# EAGLE design led_analog_watch_face_v1 (EAGLE 5.11)
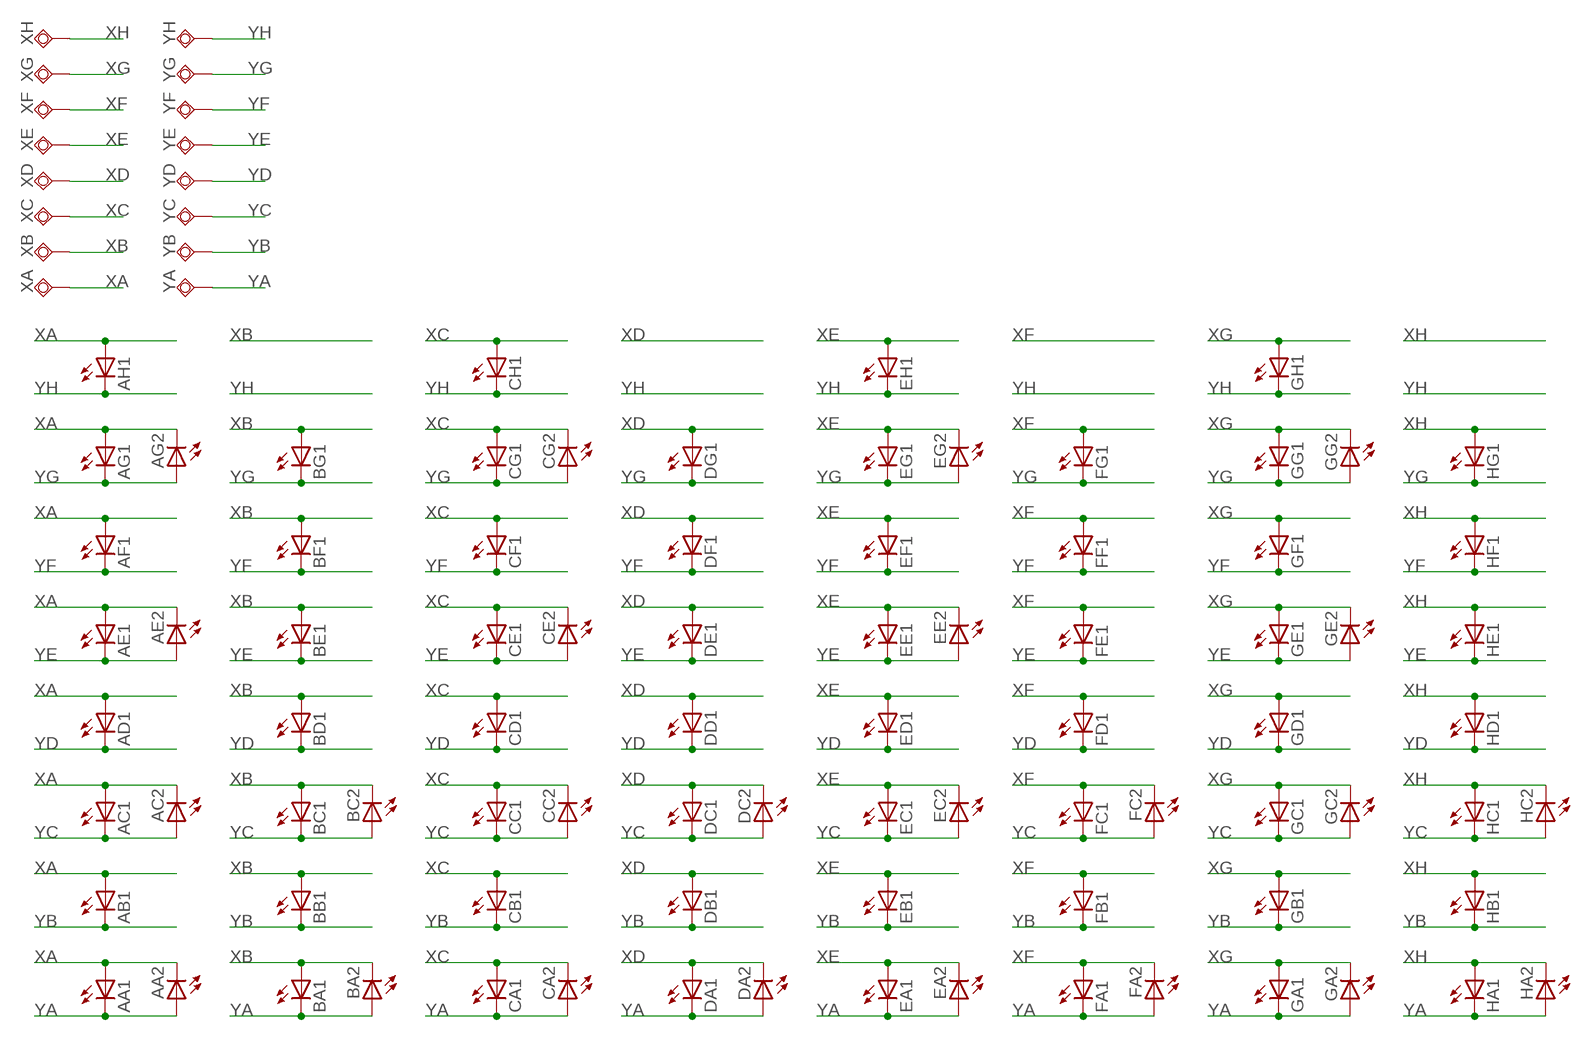
[diagram p0: schematic, sheet 1]

## Parts
AA1  LED0402  [LED-0402]
AA2  LED0402  [LED-0402]
AB1  LED0402  [LED-0402]
AC1  LED0402  [LED-0402]
AC2  LED0402  [LED-0402]
AD1  LED0402  [LED-0402]
AE1  LED0402  [LED-0402]
AE2  LED0402  [LED-0402]
AF1  LED0402  [LED-0402]
AG1  LED0402  [LED-0402]
AG2  LED0402  [LED-0402]
AH1  LED0402  [LED-0402]
BA1  LED0402  [LED-0402]
BA2  LED0402  [LED-0402]
BB1  LED0402  [LED-0402]
BC1  LED0402  [LED-0402]
BC2  LED0402  [LED-0402]
BD1  LED0402  [LED-0402]
BE1  LED0402  [LED-0402]
BF1  LED0402  [LED-0402]
BG1  LED0402  [LED-0402]
CA1  LED0402  [LED-0402]
CA2  LED0402  [LED-0402]
CB1  LED0402  [LED-0402]
CC1  LED0402  [LED-0402]
CC2  LED0402  [LED-0402]
CD1  LED0402  [LED-0402]
CE1  LED0402  [LED-0402]
CE2  LED0402  [LED-0402]
CF1  LED0402  [LED-0402]
CG1  LED0402  [LED-0402]
CG2  LED0402  [LED-0402]
CH1  LED0402  [LED-0402]
DA1  LED0402  [LED-0402]
DA2  LED0402  [LED-0402]
DB1  LED0402  [LED-0402]
DC1  LED0402  [LED-0402]
DC2  LED0402  [LED-0402]
DD1  LED0402  [LED-0402]
DE1  LED0402  [LED-0402]
DF1  LED0402  [LED-0402]
DG1  LED0402  [LED-0402]
EA1  LED0402  [LED-0402]
EA2  LED0402  [LED-0402]
EB1  LED0402  [LED-0402]
EC1  LED0402  [LED-0402]
EC2  LED0402  [LED-0402]
ED1  LED0402  [LED-0402]
EE1  LED0402  [LED-0402]
EE2  LED0402  [LED-0402]
EF1  LED0402  [LED-0402]
EG1  LED0402  [LED-0402]
EG2  LED0402  [LED-0402]
EH1  LED0402  [LED-0402]
FA1  LED0402  [LED-0402]
FA2  LED0402  [LED-0402]
FB1  LED0402  [LED-0402]
FC1  LED0402  [LED-0402]
FC2  LED0402  [LED-0402]
FD1  LED0402  [LED-0402]
FE1  LED0402  [LED-0402]
FF1  LED0402  [LED-0402]
FG1  LED0402  [LED-0402]
GA1  LED0402  [LED-0402]
GA2  LED0402  [LED-0402]
GB1  LED0402  [LED-0402]
GC1  LED0402  [LED-0402]
GC2  LED0402  [LED-0402]
GD1  LED0402  [LED-0402]
GE1  LED0402  [LED-0402]
GE2  LED0402  [LED-0402]
GF1  LED0402  [LED-0402]
GG1  LED0402  [LED-0402]
GG2  LED0402  [LED-0402]
GH1  LED0402  [LED-0402]
HA1  LED0402  [LED-0402]
HA2  LED0402  [LED-0402]
HB1  LED0402  [LED-0402]
HC1  LED0402  [LED-0402]
HC2  LED0402  [LED-0402]
HD1  LED0402  [LED-0402]
HE1  LED0402  [LED-0402]
HF1  LED0402  [LED-0402]
HG1  LED0402  [LED-0402]
XA  TPSQTP15SQ  [TP15SQ]
XB  TPSQTP15SQ  [TP15SQ]
XC  TPSQTP15SQ  [TP15SQ]
XD  TPSQTP15SQ  [TP15SQ]
XE  TPSQTP15SQ  [TP15SQ]
XF  TPSQTP15SQ  [TP15SQ]
XG  TPSQTP15SQ  [TP15SQ]
XH  TPSQTP15SQ  [TP15SQ]
YA  TPSQTP15SQ  [TP15SQ]
YB  TPSQTP15SQ  [TP15SQ]
YC  TPSQTP15SQ  [TP15SQ]
YD  TPSQTP15SQ  [TP15SQ]
YE  TPSQTP15SQ  [TP15SQ]
YF  TPSQTP15SQ  [TP15SQ]
YG  TPSQTP15SQ  [TP15SQ]
YH  TPSQTP15SQ  [TP15SQ]

## Nets
XA: AA1.1(A) AA2.2(C) AB1.1(A) AC1.1(A) AC2.2(C) AD1.1(A) AE1.1(A) AE2.2(C) AF1.1(A) AG1.1(A) AG2.2(C) AH1.1(A) XA.TP
XB: BA1.1(A) BA2.2(C) BB1.1(A) BC1.1(A) BC2.2(C) BD1.1(A) BE1.1(A) BF1.1(A) BG1.1(A) XB.TP
XC: CA1.1(A) CA2.2(C) CB1.1(A) CC1.1(A) CC2.2(C) CD1.1(A) CE1.1(A) CE2.2(C) CF1.1(A) CG1.1(A) CG2.2(C) CH1.1(A) XC.TP
XD: DA1.1(A) DA2.2(C) DB1.1(A) DC1.1(A) DC2.2(C) DD1.1(A) DE1.1(A) DF1.1(A) DG1.1(A) XD.TP
XE: EA1.1(A) EA2.2(C) EB1.1(A) EC1.1(A) EC2.2(C) ED1.1(A) EE1.1(A) EE2.2(C) EF1.1(A) EG1.1(A) EG2.2(C) EH1.1(A) XE.TP
XF: FA1.1(A) FA2.2(C) FB1.1(A) FC1.1(A) FC2.2(C) FD1.1(A) FE1.1(A) FF1.1(A) FG1.1(A) XF.TP
XG: GA1.1(A) GA2.2(C) GB1.1(A) GC1.1(A) GC2.2(C) GD1.1(A) GE1.1(A) GE2.2(C) GF1.1(A) GG1.1(A) GG2.2(C) GH1.1(A) XG.TP
XH: HA1.1(A) HA2.2(C) HB1.1(A) HC1.1(A) HC2.2(C) HD1.1(A) HE1.1(A) HF1.1(A) HG1.1(A) XH.TP
YA: AA1.2(C) AA2.1(A) BA1.2(C) BA2.1(A) CA1.2(C) CA2.1(A) DA1.2(C) DA2.1(A) EA1.2(C) EA2.1(A) FA1.2(C) FA2.1(A) GA1.2(C) GA2.1(A) HA1.2(C) HA2.1(A) YA.TP
YB: AB1.2(C) BB1.2(C) CB1.2(C) DB1.2(C) EB1.2(C) FB1.2(C) GB1.2(C) HB1.2(C) YB.TP
YC: AC1.2(C) AC2.1(A) BC1.2(C) BC2.1(A) CC1.2(C) CC2.1(A) DC1.2(C) DC2.1(A) EC1.2(C) EC2.1(A) FC1.2(C) FC2.1(A) GC1.2(C) GC2.1(A) HC1.2(C) HC2.1(A) YC.TP
YD: AD1.2(C) BD1.2(C) CD1.2(C) DD1.2(C) ED1.2(C) FD1.2(C) GD1.2(C) HD1.2(C) YD.TP
YE: AE1.2(C) AE2.1(A) BE1.2(C) CE1.2(C) CE2.1(A) DE1.2(C) EE1.2(C) EE2.1(A) FE1.2(C) GE1.2(C) GE2.1(A) HE1.2(C) YE.TP
YF: AF1.2(C) BF1.2(C) CF1.2(C) DF1.2(C) EF1.2(C) FF1.2(C) GF1.2(C) HF1.2(C) YF.TP
YG: AG1.2(C) AG2.1(A) BG1.2(C) CG1.2(C) CG2.1(A) DG1.2(C) EG1.2(C) EG2.1(A) FG1.2(C) GG1.2(C) GG2.1(A) HG1.2(C) YG.TP
YH: AH1.2(C) CH1.2(C) EH1.2(C) GH1.2(C) YH.TP

## Library data of the parts
AA1 AA2 AB1 AC1 AC2 AD1 AE1 AE2 AF1 AG1 AG2 AH1 BA1 BA2 BB1 BC1 BC2 BD1 BE1 BF1 BG1 CA1 CA2 CB1 CC1 CC2 CD1 CE1 CE2 CF1 CG1 CG2 CH1 DA1 DA2 DB1 DC1 DC2 DD1 DE1 DF1 DG1 EA1 EA2 EB1 EC1 EC2 ED1 EE1 EE2 EF1 EG1 EG2 EH1 FA1 FA2 FB1 FC1 FC2 FD1 FE1 FF1 FG1 GA1 GA2 GB1 GC1 GC2 GD1 GE1 GE2 GF1 GG1 GG2 GH1 HA1 HA2 HB1 HC1 HC2 HD1 HE1 HF1 HG1 = jcole:LED: LEDs Standard schematic elements and footprints for 5mm, 3mm, 1206, and 0603 sized LEDs. 5mm - Spark Fun Electronics SKU : COM-00529 (and others)
XA XB XC XD XE XF XG XH YA YB YC YD YE YF YG YH = testpad:TPSQ: Test pad

## Net classes
0 signal: width 0.203 mm
1 supply: width 0.305 mm

## Board
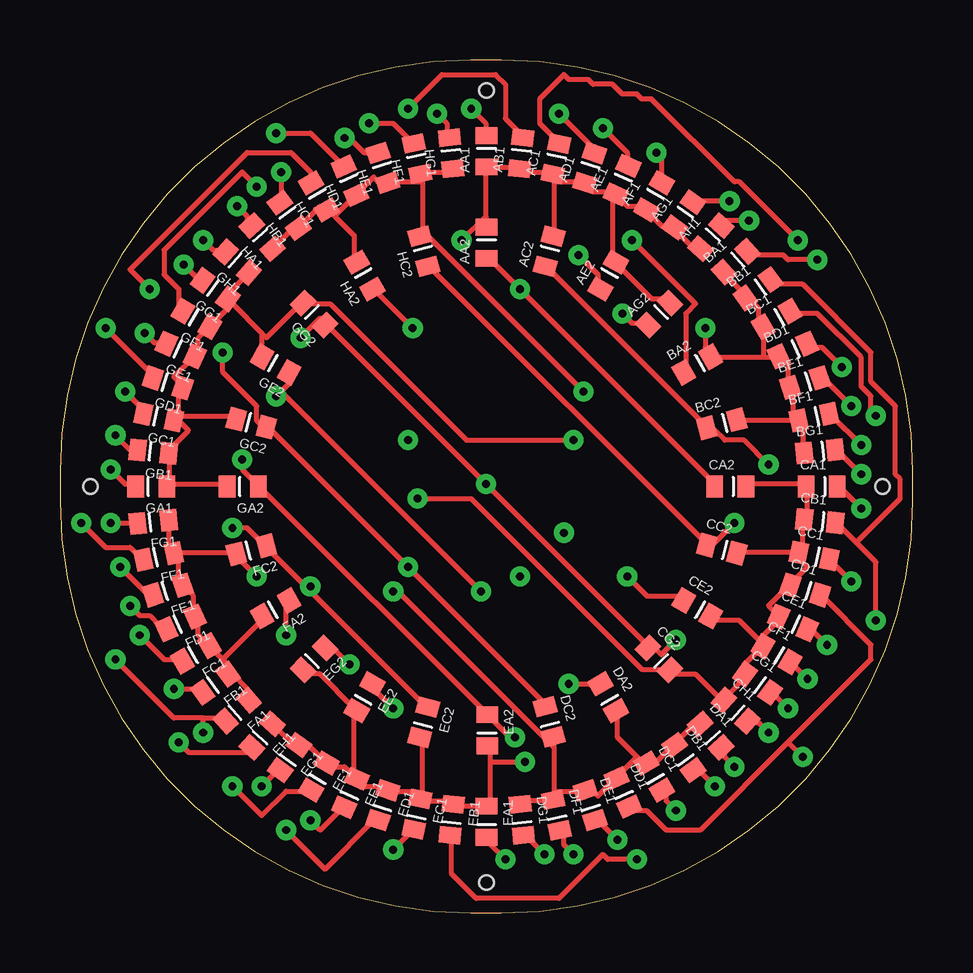
[diagram p1: board, top side]
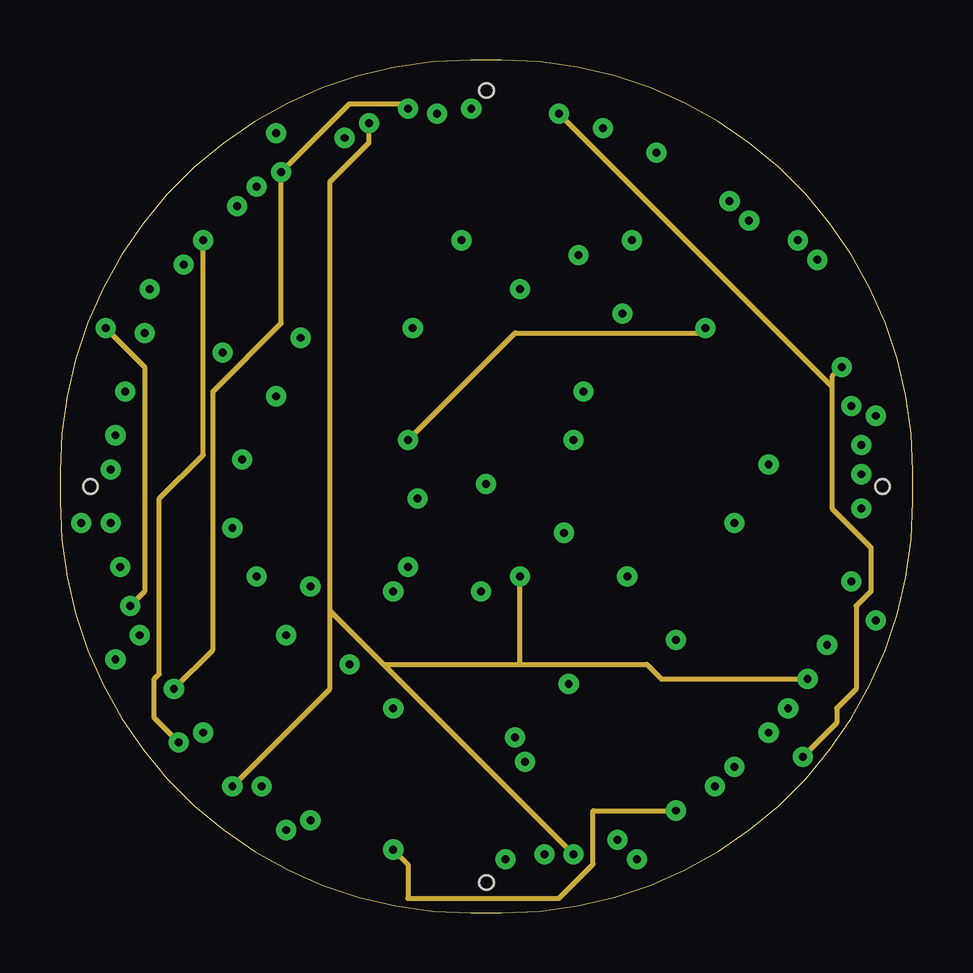
[diagram p2: board, inner layer Route2]
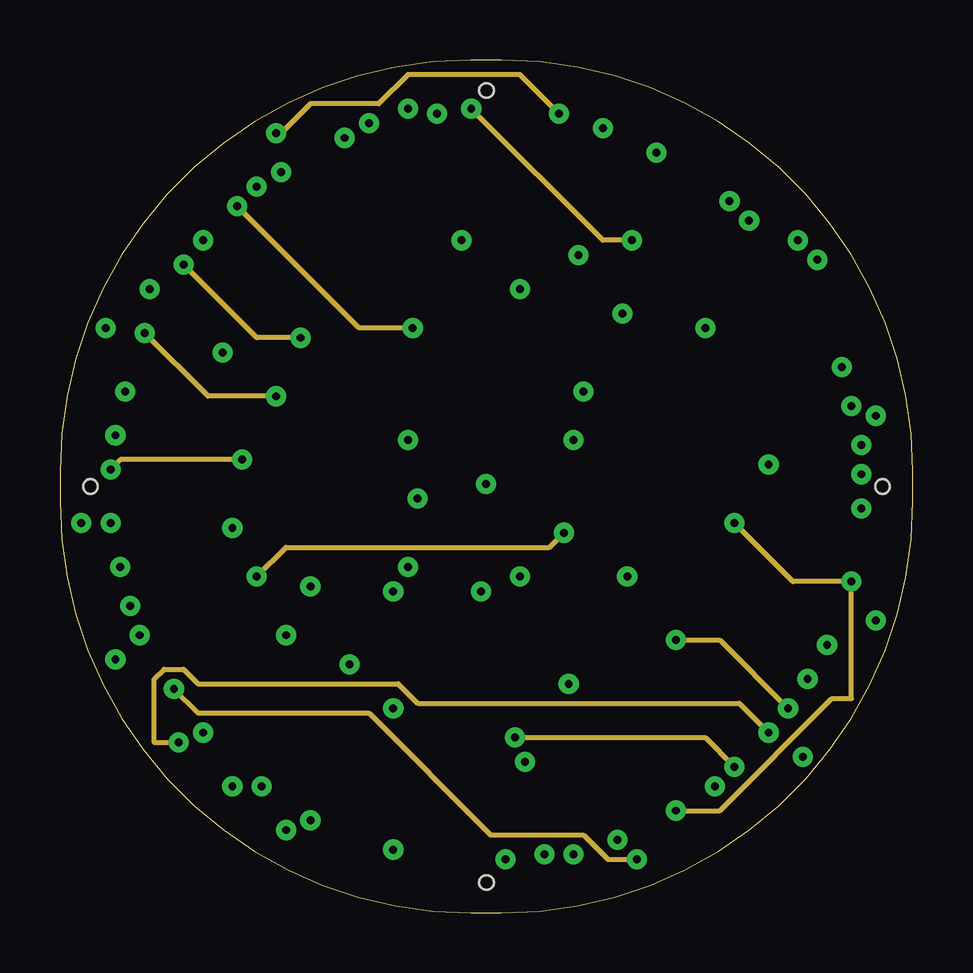
[diagram p3: board, inner layer Route15]
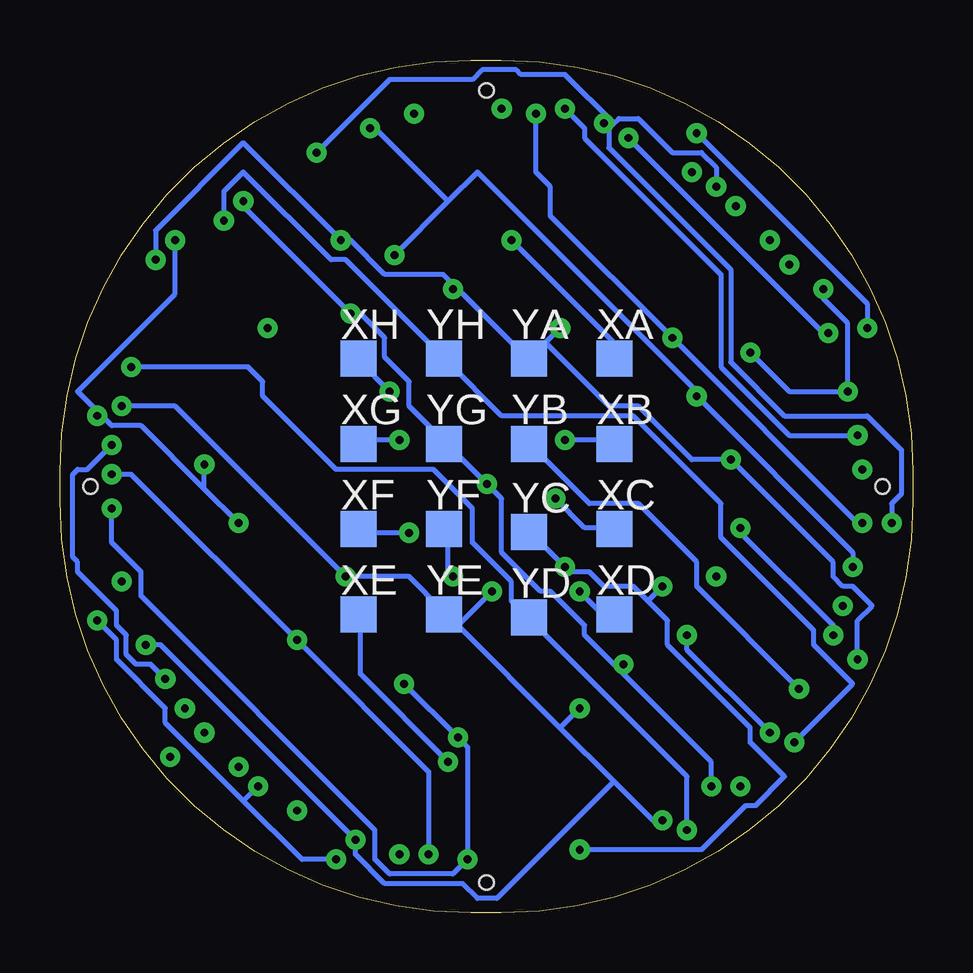
[diagram p4: board, bottom side, seen from below]

Size 35.56 x 35.56 mm. Coordinates in mm from the lower left corner, seen from the top.
Outline: 18.42,0 arc90 35.56,17.14 35.56,18.41 arc90 18.42,35.56 17.14,35.56 arc90 0,18.41 0,17.14 arc90 17.14,0 18.42,0
Copper layers (1*2*15*16): Top 0.035mm / dielectric 0.6mm / Route2 0.035mm / dielectric 0.15mm / Route15 0.035mm / dielectric 0.6mm / Bottom 0.035mm
Design rules "SparkFun *": minimum track width 8mil, minimum drill 13mil, track to track 8mil, track to pad 8mil, pad to pad 8mil, via to via 8mil, smd to smd 8mil, copper to edge 10mil, drill to drill 8mil, minimum pad ring 12mil, minimum via ring 10mil, stop-mask expansion 4mil, vias tented up to drill 25mil, thermal gap 10mil
Holes 0.6 mm at 17.78,1.27 34.29,17.78 1.27,17.78 17.78,34.29

### Footprints (pad centres in the part's own frame; a part is rotated, then mirrored left to right if it is on the bottom)
LED-0402 = smd 0.9 x 0.7: 1 0,-0.65; 2 0,0.65
TP15SQ = smd 1.5 x 1.5: TP 0,0

### Placement (x,y rotation side)
AA1  17.78,31.75 0 top
AA2  17.78,27.94 0 top
AB1  19.23,31.67 354 top
AC1  20.68,31.44 348 top
AC2  20.4,27.58 345 top
AD1  22.08,31.06 342 top
AE1  23.43,30.55 336 top
AE2  22.86,26.57 330 top
AF1  24.77,29.88 330 top
AG1  26,29.1 324 top
AG2  24.97,24.97 315 top
AH1  27.14,28.18 318 top
BA1  28.17,27.15 312 top
BA2  26.57,22.86 300 top
BB1  29.1,26.02 306 top
BC1  29.87,24.76 300 top
BC2  27.58,20.4 285 top
BD1  30.55,23.47 294 top
BE1  31.06,22.11 288 top
BF1  31.43,20.67 282 top
BG1  31.67,19.25 276 top
CA1  31.75,17.78 270 top
CA2  27.94,17.78 270 top
CB1  31.67,16.33 264 top
CC1  31.45,14.88 258 top
CC2  27.58,15.16 255 top
CD1  31.06,13.46 252 top
CE1  30.56,12.09 246 top
CE2  26.57,12.7 240 top
CF1  29.87,10.79 240 top
CG1  29.08,9.58 234 top
CG2  24.97,10.59 225 top
CH1  28.17,8.43 228 top
DA1  27.13,7.39 222 top
DA2  22.86,8.99 210 top
DB1  26.01,6.48 216 top
DC1  24.77,5.69 210 top
DC2  20.4,7.98 195 top
DD1  23.47,5.03 204 top
DE1  22.1,4.5 198 top
DF1  20.7,4.09 192 top
DG1  19.25,3.89 186 top
EA1  17.78,3.81 180 top
EA2  17.81,7.62 180 top
EB1  16.33,3.89 174 top
EC1  14.88,4.11 168 top
EC2  15.16,7.95 165 top
ED1  13.46,4.5 162 top
EE1  12.12,5 156 top
EE2  12.7,8.99 150 top
EF1  10.79,5.69 150 top
EG1  9.58,6.48 144 top
EG2  10.59,10.59 135 top
EH1  8.43,7.39 138 top
FA1  7.39,8.43 132 top
FA2  8.99,12.7 120 top
FB1  6.48,9.58 126 top
FC1  5.66,10.82 120 top
FC2  7.98,15.14 105 top
FD1  5.03,12.09 114 top
FE1  4.5,13.46 108 top
FF1  4.11,14.86 102 top
FG1  3.89,16.31 96 top
GA1  3.81,17.78 90 top
GA2  7.62,17.78 90 top
GB1  3.89,19.23 84 top
GC1  4.11,20.68 78 top
GC2  7.98,20.42 75 top
GD1  4.5,22.1 72 top
GE1  5.03,23.47 66 top
GE2  8.99,22.86 60 top
GF1  5.69,24.77 60 top
GG1  6.48,25.98 54 top
GG2  10.59,24.97 45 top
GH1  7.39,27.13 48 top
HA1  8.43,28.17 42 top
HA2  12.7,26.57 30 top
HB1  9.55,29.08 36 top
HC1  10.79,29.87 30 top
HC2  15.16,27.58 15 top
HD1  12.09,30.53 24 top
HE1  13.46,31.06 18 top
HF1  14.88,31.45 12 top
HG1  16.31,31.67 6 top
XA  12.45,23.11 0 bottom
XB  12.45,19.56 0 bottom
XC  12.45,16 0 bottom
XD  12.45,12.45 0 bottom
XE  23.11,12.45 0 bottom
XF  23.11,16 0 bottom
XG  23.11,19.56 0 bottom
XH  23.11,23.11 0 bottom
YA  16,23.11 0 bottom
YB  16,19.56 0 bottom
YC  16,15.88 0 bottom
YD  16,12.32 0 bottom
YE  19.56,12.45 0 bottom
YF  19.56,16 0 bottom
YG  19.56,19.56 0 bottom
YH  19.56,23.11 0 bottom

### Tracks (layer width: path | path; a pad name or v marks a point on that pad's centre or on a via)
XA  (via drill 0.33)
  Top 0.203: AE1.1 23.04,30.07 22.23,30.07 22.02,30.28 AD1.1 21.82,30.48 20.6,30.48 | AE1.1 23.04,29.87 23.04,27.23 AE2.2 23.24,27.03 24.66,25.6 25.27,25.6 AG2.2 | AE1.1 23.24,29.87 23.65,29.46 24.26,29.46 AF1.1 24.46,29.26 25.07,28.65 25.48,28.65 AG1.1 25.68,28.45 26.29,27.84 26.7,27.84 AH1.1 | 17.76,29.06 17.76,31.09 AA1.1 17.96,31.09 18.97,31.09 AB1.1 19.18,30.89 20.4,30.89 AC1.1 | 17.76,29.06 17.76,28.65 AA2.2 | 20.6,30.48 20.6,30.68 AC1.1 | 20.6,30.48 20.6,28.25 AC2.2 | v16.74,28.04 17.76,29.06 | AC1.1 20.6,30.48
  Bottom 0.203: v16.74,28.04 12.47,23.77 12.47,23.16 XA.TP
XB  (via drill 0.33)
  Top 0.203: BC2.2 28.32,20.52 30.76,20.52 BF1.1 | BG1.1 30.96,19.3 30.96,20.52 BF1.1 | BF1.1 30.76,20.73 30.56,20.93 30.56,21.74 BE1.1 30.35,21.95 30.35,22.96 30.15,23.16 BD1.1 29.95,23.16 29.34,23.16 | BA1.1 27.71,26.62 28.52,25.81 BB1.1 28.73,25.6 29.13,25.2 29.13,24.59 BC1.1 29.34,24.38 29.34,23.16 | 29.34,23.16 27.3,23.16 BA2.2 27.1,23.37 26.9,23.57 v26.9,24.38
  Route2 0.203: v14.5,19.71 18.97,24.18 26.9,24.18 v26.9,24.38
  Bottom 0.203: v14.5,19.71 12.47,19.71 XB.TP
XC  (via drill 0.33)
  Top 0.203: CA2.2 28.73,17.88 30.96,17.88 CA1.1 31.17,17.68 31.17,16.46 CB1.1 30.96,16.26 30.96,15.04 CC1.1 | CC1.1 30.76,14.83 31.17,14.43 30.56,13.82 CD1.1 30.35,13.61 29.54,12.8 29.95,12.39 CE1.1 29.95,12.19 29.13,11.38 | CC2.2 28.32,15.04 30.76,15.04 CC1.1 | CF1.1 29.13,10.97 28.52,10.36 28.73,10.16 CG1.1 28.73,9.96 27.71,8.94 CH1.1 27.51,8.94 26.49,9.96 25.48,9.96 CG2.2 25.27,10.16 24.26,10.16 17.14,17.27 v14.91,17.27 | 29.13,11.38 29.34,11.18 CF1.1 | 29.13,11.38 28.32,12.19 27.3,12.19 CE2.2 | CF1.1 29.13,11.38
  Bottom 0.203: v14.91,17.27 13.69,16.05 12.47,16.05 XC.TP
XD  (via drill 0.33)
  Top 0.203: DA1.1 26.49,7.92 25.68,7.11 DB1.1 25.48,6.91 24.66,6.1 24.46,6.3 DC1.1 24.26,6.3 24.05,6.5 | 24.05,6.5 23.24,5.69 DD1.1 23.04,5.49 22.43,4.88 22.02,5.28 DE1.1 21.82,5.08 20.6,5.08 | 24.05,6.5 23.24,7.32 23.24,8.33 DA2.2 | DG1.1 19.38,4.67 20.4,4.67 DF1.1 | 20.6,5.08 20.6,4.88 DF1.1 | 20.6,6.91 20.6,5.08 | 20.6,6.91 20.6,7.32 DC2.2 | 20.6,5.08 DF1.1 | v13.89,13.41 14.1,13.41 20.6,6.91
  Bottom 0.203: v13.89,13.41 13.08,12.6 12.47,12.6 XD.TP
XE  (via drill 0.33)
  Top 0.203: EH1.1 9.02,7.72 9.63,7.11 9.83,7.11 EG1.1 10.03,6.91 10.44,6.91 11.05,6.3 EF1.1 11.25,6.1 11.86,6.1 12.27,5.69 | 12.27,5.69 12.27,8.33 EE2.2 12.27,8.53 10.85,9.96 10.24,9.96 EG2.2 | 12.27,5.69 EE1.1 12.47,5.49 12.67,5.28 13.49,5.28 ED1.1 13.69,5.08 14.71,5.08 14.91,4.88 EC1.1 | EC2.2 15.11,7.32 15.11,4.88 EC1.1 | EC1.1 15.11,4.67 16.33,4.67 EB1.1 16.54,4.47 17.76,4.47 EA1.1 17.96,4.47 17.96,6.3 | 17.96,6.3 17.96,6.91 EA2.2 | 17.96,6.3 v19.38,6.3
  Bottom 0.203: v19.38,6.3 23.04,9.96 23.04,12.39 XE.TP
XF  (via drill 0.33)
  Top 0.203: 6.78,10.57 6.38,10.97 FC1.1 6.17,11.18 5.77,11.58 5.77,12.19 FD1.1 5.56,12.39 5.56,13.21 5.16,13.61 FE1.1 4.95,13.82 4.95,14.83 FF1.1 | 6.78,10.57 6.99,10.36 6.99,10.16 FB1.1 7.19,9.96 7.8,9.35 7.8,8.94 FA1.1 | 6.78,10.57 8.41,12.19 FA2.2 | FF1.1 4.95,15.04 7.19,15.04 FC2.2 7.39,14.83 v8.2,14.02 | FG1.1 4.55,16.26 4.55,15.24 4.75,15.04 FF1.1
  Route15 0.203: v21.01,15.85 20.4,15.24 9.42,15.24 v8.2,14.02
  Bottom 0.203: v21.01,15.85 23.04,15.85 XF.TP
XG  (via drill 0.33)
  Top 0.203: 4.55,17.88 4.55,19.1 GB1.1 4.55,19.3 5.36,20.12 4.95,20.52 GC1.1 4.95,20.73 | 4.55,17.88 6.78,17.88 GA2.2 | 4.55,17.88 GA1.1 | 4.95,20.73 4.95,21.74 GD1.1 5.16,21.95 4.75,22.35 5.56,23.16 GE1.1 5.77,23.37 5.77,23.98 6.17,24.38 GF1.1 6.38,24.59 7.19,25.4 | 4.95,20.73 7.19,20.73 GC2.2 | 8.41,24.18 8.41,23.37 GE2.2 | 7.19,25.4 8.41,24.18 | 7.19,25.4 GG1.1 7.19,25.6 6.99,25.81 7.8,26.62 GH1.1 | 8.41,24.18 8.61,23.98 10.03,25.4 GG2.2 10.24,25.4 11.25,25.4 16.94,19.71 v21.41,19.71
  Bottom 0.203: v21.41,19.71 23.04,19.71 XG.TP
XH  (via drill 0.33)
  Top 0.203: HA1.1 9.02,27.84 9.83,28.65 HB1.1 10.03,28.65 10.85,29.46 11.05,29.26 HC1.1 11.25,29.26 11.46,29.06 | 11.46,29.06 12.27,28.25 12.27,27.23 HA2.2 | 11.46,29.06 12.27,29.87 HD1.1 12.47,30.07 13.08,30.68 13.49,30.28 HE1.1 13.69,30.48 15.11,30.48 | 15.11,30.48 15.11,30.68 HF1.1 | 15.11,30.48 15.11,28.45 | 15.11,28.45 15.11,28.25 HC2.2 15.11,28.45 | 15.11,30.48 HF1.1 | HG1.1 16.33,30.89 15.11,30.89 HF1.1 | 15.11,28.45 v21.82,21.74
  Bottom 0.203: v21.82,21.74 23.04,22.96 XH.TP
YA  (via drill 0.33)
  Top 0.203: v18.57,2.23 17.96,2.85 17.96,3.05 EA1.2 | v18.97,7.32 18.77,7.32 17.96,8.13 EA2.1 17.76,8.33 8.41,17.68 GA2.1 8.2,17.88 7.6,18.49 v7.6,18.9 | v21.21,9.55 22.43,9.55 DA2.1 | v28.12,6.1 27.71,6.5 27.71,6.71 DA1.2 | v33.4,16.87 32.59,17.68 CA1.2 | CA2.1 27.1,17.88 27.1,18.09 v19.18,26.01 17.96,27.23 AA2.1 | v2.11,18.49 2.72,17.88 3.12,17.88 GA1.2 | 5.97,8.13 4.75,8.13 v2.31,10.57 | 5.97,8.13 6.78,8.13 FA1.2 | v9.42,11.58 9.42,13.01 FA2.1 | v5.97,7.52 5.97,8.13 | v14.71,24.38 13.28,25.81 13.08,25.81 HA2.1 | v7.39,29.46 7.8,29.06 7.8,28.85 HA1.2 | v23.85,28.04 26.49,25.4 26.09,24.99 26.09,22.55 BA2.1 | v31.57,27.23 30.35,27.23 30.15,27.43 28.73,27.43 BA1.2 | v17.14,33.53 17.76,32.92 17.76,32.51 AA1.2
  Route15 0.203: v28.12,6.1 26.9,7.32 v18.97,7.32 | v2.11,18.49 2.51,18.9 v7.6,18.9 | v7.39,29.46 12.47,24.38 v14.71,24.38 | v17.14,33.53 22.63,28.04 v23.85,28.04
  Bottom 0.203: v21.21,9.55 v18.97,7.32 18.57,6.91 v18.57,2.23 19.18,1.63 21.82,1.63 22.43,2.23 22.43,3.45 32.18,13.21 32.18,14.22 33.4,15.44 v33.4,16.87 | v2.31,10.57 2.31,12.19 1.7,12.8 2.51,13.61 2.92,13.61 3.33,14.02 3.33,14.63 v7.6,18.9 9.22,18.9 11.46,21.13 12.67,21.13 15.32,23.77 | v9.42,11.58 9.42,10.97 v5.97,7.52 | 15.32,23.77 15.93,23.16 YA.TP | 15.32,23.77 v14.71,24.38 | 18.97,26.01 16.13,23.16 YA.TP | 18.97,26.01 19.58,26.62 22.02,26.62 23.44,28.04 v23.85,28.04 27.92,32.11 31.57,28.45 v31.57,27.23 | 15.32,23.77 YA.TP | 18.97,26.01 v19.18,26.01
YB  (via drill 0.33)
  Top 0.203: v4.75,9.35 5.77,9.35 FB1.2 | v2.31,19.91 2.92,19.3 3.12,19.3 GB1.2 | v14.5,33.53 15.93,34.95 18.16,34.95 18.57,34.54 18.57,33.12 19.18,32.51 AB1.2 | v9.22,30.89 9.22,29.67 HB1.2 | v24.05,2.23 22.84,2.23 22.63,2.44 20.8,0.61 17.35,0.61 16.33,1.63 16.33,3.05 EB1.2 | v34.01,12.19 34.01,14.63 33.2,15.44 | 33.2,15.44 32.38,16.26 CB1.2 | v27.3,5.28 26.7,5.89 26.49,5.89 DB1.2 | 33.2,15.44 35.03,17.27 35.03,18.09 34.82,18.29 34.82,21.13 33.81,22.15 33.81,23.37 30.96,26.21 29.74,26.21 BB1.2
  Route2 0.203: v14.5,33.53 14.5,33.73 12.06,33.73 v9.22,30.89 9.22,24.59 6.38,21.74 6.38,10.97 v4.75,9.35
  Route15 0.203: v4.75,9.35 5.77,8.33 12.88,8.33 17.96,3.25 21.82,3.25 22.84,2.23 v24.05,2.23
  Bottom 0.203: v4.75,9.35 9.02,13.61 9.02,14.63 11.46,17.07 13.49,17.07 15.93,19.51 YB.TP | v2.31,19.91 5.16,19.91 8,22.76 8,26.62 13.69,32.31 13.69,32.72 v14.5,33.53 | v24.05,2.23 25.48,2.23 27.92,4.67 | 27.92,4.67 31.17,7.92 31.17,8.53 33.2,10.57 33.2,11.38 v34.01,12.19 | 27.92,4.67 v27.3,5.28
YC  (via drill 0.33)
  Top 0.203: DC2.1 20.19,8.74 v14.5,14.43 8.81,20.12 8.61,20.12 GC2.1 8.41,20.32 8.2,20.52 8.2,21.13 6.78,22.55 v6.78,23.37 | v2.72,21.74 3.33,21.13 3.33,20.93 GC1.2 | v3.73,26.01 2.92,26.82 7.8,31.7 9.63,31.7 10.44,30.89 10.44,30.48 HC1.2 | AC2.1 20.4,26.82 26.9,20.32 BC2.1 27.1,20.12 27.3,20.12 27.71,19.71 28.52,19.71 v29.54,18.69 | HC2.1 15.52,26.82 26.9,15.44 CC2.1 27.1,15.24 v28.12,16.26 | v34.01,20.73 33.81,20.93 33.81,21.54 33.4,21.95 33.4,23.16 31.57,24.99 30.56,24.99 BC1.2 | v30.76,28.04 28.32,30.48 28.12,30.48 24.66,33.93 24.26,33.93 24.05,34.14 23.44,34.14 23.04,34.54 22.23,34.54 22.02,34.75 21.21,34.75 21.01,34.95 19.99,33.93 19.99,32.92 20.8,32.11 AC1.2 | v3.33,11.58 4.34,10.57 4.95,10.57 FC1.2 | v7.19,16.05 7.8,16.05 8.41,15.44 FC2.1 8.61,15.24 10.44,13.41 | 10.44,13.41 15.11,8.74 15.32,8.74 EC2.1 | v13.89,2.64 14.71,3.45 EC1.2 | v25.68,4.27 25.27,4.67 25.27,5.08 DC1.2 | v32.99,13.82 32.18,14.63 CC1.2 | v10.44,13.61 10.44,13.41
  Route2 0.203: v25.68,4.27 22.23,4.27 22.23,2.03 20.8,0.61 14.5,0.61 14.5,2.03 v13.89,2.64
  Route15 0.203: v25.68,4.27 27.51,4.27 32.18,8.94 32.99,8.94 v32.99,13.82 30.56,13.82 v28.12,16.26
  Bottom 0.203: v6.78,23.37 5.16,21.74 v2.72,21.74 2.72,24.59 3.73,25.6 v3.73,26.01 | 33.81,20.73 33.4,20.32 32.18,20.32 29.54,17.68 | v28.12,16.26 29.54,17.68 | v30.76,28.04 30.76,25.81 34.82,21.74 33.81,20.73 | 33.81,20.73 v34.01,20.73 | 29.54,17.68 v29.54,18.69 | v3.33,11.58 3.33,11.99 7.19,15.85 v7.19,16.05 | v13.89,2.64 8.81,2.64 6.99,4.47 6.58,4.47 5.36,5.69 6.78,7.11 6.78,7.72 10.24,11.18 10.24,12.19 11.05,13.01 | 11.05,13.01 11.66,13.61 12.88,13.61 13.49,14.22 14.3,14.22 v14.5,14.43 15.93,15.85 YC.TP | 11.05,13.01 v10.44,13.61
YD  (via drill 0.33)
  Top 0.203: v1.91,24.38 3.73,22.55 3.73,22.35 GD1.2 | v9.02,32.51 10.44,32.51 11.66,31.29 HD1.2 | v2.92,12.8 3.33,12.39 3.73,12.39 4.14,11.99 4.34,11.99 FD1.2 | v20.8,33.33 22.23,31.9 22.23,31.7 AD1.2 | 30.35,7.11 33.81,10.57 33.81,11.18 31.78,13.21 CD1.2 | 30.35,7.11 26.7,3.45 25.27,3.45 24.46,4.27 23.85,4.27 DD1.2 | v9.42,3.45 11.05,1.83 13.08,3.86 ED1.2 | v32.59,22.76 31.78,23.57 31.17,23.57 BD1.2 | v30.96,6.5 30.35,7.11
  Route2 0.203: v2.92,12.8 3.53,13.41 3.53,22.76 v1.91,24.38 | v30.96,6.5 32.38,7.92 32.38,8.53 33.2,9.35 33.2,12.8 33.81,13.41 33.81,15.24 32.18,16.87 32.18,21.95 | 32.18,21.95 32.18,22.35 v32.59,22.76 | 32.18,21.95 v20.8,33.33
  Route15 0.203: v20.8,33.33 19.18,34.95 14.5,34.95 13.28,33.73 10.44,33.73 9.22,32.51 v9.02,32.51
  Bottom 0.203: v1.91,24.38 1.91,25.4 v9.02,32.51 | v9.42,3.45 9.42,5.69 15.93,12.19 YD.TP 16.13,12.39 16.74,13.01 16.74,13.82 18.36,15.44 18.36,16.87 19.99,18.49 24.05,18.49 27.1,21.54 27.1,22.15 27.71,22.76 v32.59,22.76
YE  (via drill 0.33)
  Top 0.203: v2.51,14.43 3.53,13.41 3.73,13.41 FE1.2 | 9.22,21.74 9.63,22.15 9.42,22.35 GE2.1 | v3.53,24.18 3.94,23.77 4.34,23.77 GE1.2 | v21.62,27.43 22.43,26.62 22.43,26.01 AE2.1 | v22.63,32.72 23.65,31.7 23.65,31.29 AE1.2 | v11.86,32.31 12.06,32.31 12.67,31.7 13.08,31.7 HE1.2 | v10.44,3.86 10.85,3.45 11.66,4.27 EE1.2 | v13.89,8.53 13.08,9.35 13.08,9.55 EE2.1 | v23.24,3.05 22.43,3.86 DE1.2 | v23.65,14.02 24.46,13.21 25.88,13.21 CE2.1 | v31.98,11.18 31.37,11.79 31.17,11.79 CE1.2 | v32.99,21.13 31.98,22.15 31.78,22.15 BE1.2 | v17.55,13.41 9.22,21.74 | 9.22,21.74 v9.02,21.54
  Route15 0.203: v3.53,24.18 6.17,21.54 v9.02,21.54
  Bottom 0.203: v2.51,14.43 2.51,15.04 v9.02,21.54 9.02,21.74 18.16,30.89 19.38,29.67 | 19.38,29.67 v21.62,27.43 | v22.63,32.72 22.43,32.72 19.38,29.67 | v11.86,32.31 3.73,24.18 v3.53,24.18 | v10.44,3.86 10.85,3.86 12.47,5.49 | 18.97,11.99 19.38,12.39 YE.TP | 14.71,7.72 18.97,11.99 | 12.47,5.49 14.71,7.72 | 14.71,7.72 v13.89,8.53 | 12.47,5.49 17.35,0.61 18.16,0.61 18.77,1.22 22.02,1.22 23.24,2.44 v23.24,3.05 31.37,11.18 v31.98,11.18 | YE.TP 19.58,12.6 21.01,14.02 v23.65,14.02 30.76,21.13 v32.99,21.13 | 18.97,11.99 v17.55,13.41 | 18.97,11.99 YE.TP
YF  (via drill 0.33)
  Top 0.203: v0.89,16.26 1.91,15.24 2.92,15.24 3.33,14.83 FF1.2 | v12.88,32.92 13.89,32.92 14.71,32.11 HF1.2 | v7.19,5.28 8.41,4.06 9.42,5.08 10.44,5.08 EF1.2 | v21.41,2.44 21.01,2.85 21.01,3.25 DF1.2 | v31.17,9.75 30.56,10.36 CF1.2 | v33.4,19.51 32.18,20.73 BF1.2 | v8.2,30.28 7.6,30.89 4.34,27.64 4.34,26.62 4.95,26.01 4.95,25.2 GF1.2 | v24.87,31.7 25.07,31.5 25.07,30.48 AF1.2
  Route2 0.203: v7.19,5.28 11.25,9.35 11.25,12.6 | 11.25,12.6 11.25,30.48 12.88,32.11 v12.88,32.92 | 11.25,12.6 13.49,10.36 | 13.49,10.36 v21.41,2.44 | v31.17,9.75 25.07,9.75 24.46,10.36 19.18,10.36 | 13.49,10.36 19.18,10.36 | 19.18,10.36 v19.18,14.02
  Bottom 0.203: v0.89,16.26 0.89,17.07 0.48,17.48 0.48,19.3 1.91,20.73 5.36,20.73 7.6,22.96 7.6,26.82 12.67,31.9 12.67,32.72 | v33.4,19.51 34.42,18.49 34.82,18.49 35.03,18.29 35.03,14.83 34.82,14.63 34.82,14.22 33.2,12.6 33.2,11.99 32.79,11.58 32.79,10.77 32.38,10.36 31.78,10.36 v31.17,9.75 | v8.2,30.28 8.2,31.09 8.81,31.7 10.03,31.7 11.46,33.12 12.27,33.12 12.47,32.92 | 12.67,32.72 12.47,32.92 | 12.67,32.72 v12.88,32.92 12.47,32.92 | v24.87,31.7 21.82,34.75 18.36,34.75 17.96,35.15 16.54,35.15 16.33,34.95 14.5,34.95 12.47,32.92 | v19.18,14.02 19.38,14.22 19.38,15.85 YF.TP
YG  (via drill 0.33)
  Top 0.203: v8.41,5.28 9.02,5.89 EG1.2 | v12.06,10.36 11.46,10.97 11.25,10.97 EG2.1 | v23.44,24.99 23.85,24.59 24.46,24.59 AG2.1 | v27.92,29.67 26.49,29.67 AG1.2 | v20.19,2.44 19.58,3.05 19.38,3.05 DG1.2 | v25.68,11.38 25.07,10.77 24.66,11.18 CG2.1 24.46,11.18 v17.76,17.88 11.25,24.38 GG2.1 11.05,24.59 10.85,24.79 v10.03,23.98 | v30.35,8.53 29.74,9.14 CG1.2 | v33.4,18.29 32.38,19.3 BG1.2 | v2.11,16.26 3.12,16.26 FG1.2 | v5.16,27.03 5.77,26.42 GG1.2 | v15.72,33.33 16.13,32.92 16.13,32.51 HG1.2
  Route15 0.203: v30.35,8.53 27.51,11.38 v25.68,11.38 | v5.16,27.03 8.2,23.98 v10.03,23.98
  Bottom 0.203: v8.41,5.28 8.41,6.3 12.27,10.16 | 12.27,10.16 13.69,11.58 13.69,11.99 15.11,13.41 15.52,13.41 17.14,15.04 17.14,17.27 v17.76,17.88 19.38,19.51 YG.TP 19.58,19.71 21.01,21.13 21.01,22.15 22.02,23.16 22.02,23.98 23.04,24.99 v23.44,24.99 27.92,29.46 v27.92,29.67 | 12.27,10.16 v12.06,10.36 | v20.19,2.44 20.19,5.89 v25.68,11.38 32.59,18.29 v33.4,18.29 | v2.11,16.26 2.31,16.26 v10.03,23.98 15.11,29.06 15.11,30.28 15.72,30.89 v15.72,33.33
YH  (via drill 0.33)
  Top 0.203: v4.95,7.11 5.36,6.71 7.8,6.71 EH1.2 | v29.54,7.52 29.13,7.92 28.73,7.92 CH1.2 | v5.97,28.04 6.38,27.64 6.78,27.64 GH1.2 | v28.73,28.85 27.71,28.85 AH1.2
  Route2 0.203: v5.97,28.04 5.97,19.1 4.14,17.27 4.14,9.96 3.94,9.75 3.94,8.13 v4.95,7.11
  Route15 0.203: v29.54,7.52 28.32,8.74 14.91,8.74 14.1,9.55 5.77,9.55 5.16,10.16 4.34,10.16 3.94,9.75 3.94,7.11 v4.95,7.11
  Bottom 0.203: v4.95,7.11 2.51,9.55 4.14,11.18 4.14,11.79 8,15.65 8,17.07 11.66,20.73 17.14,20.73 19.38,22.96 YH.TP 19.58,23.16 23.65,27.23 24.26,27.23 27.92,30.89 28.73,30.07 v28.73,28.85